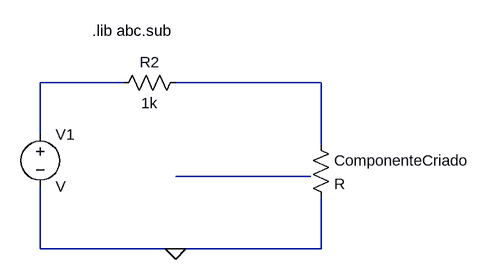
[diagram p0: schematic ex13.asc]
ex13.asc, the LTspice schematic file:
Version 4
SHEET 1 880 680
WIRE 128 176 0 176
WIRE 432 176 208 176
WIRE 0 256 0 176
WIRE 432 272 432 176
WIRE 416 320 208 320
WIRE 0 432 0 336
WIRE 208 432 0 432
WIRE 432 432 432 352
WIRE 432 432 208 432
FLAG 208 432 0
SYMBOL voltage 0 240 R0
SYMATTR InstName V1
SYMBOL res 416 256 R0
SYMATTR InstName ComponenteCriado
SYMBOL res 112 192 R270
WINDOW 0 32 56 VTop 2
WINDOW 3 0 56 VBottom 2
SYMATTR InstName R2
SYMATTR Value 1k
TEXT 80 96 Left 2 !.lib abc.sub

The netlist it stands for:
* ex13.asc
V1 N001 0 V
R§ComponenteCriado N002 0 R
R2 N001 N002 1k
.lib abc.sub
.backanno
.end